# Altium project class_ab_three_stage.PrjPcb
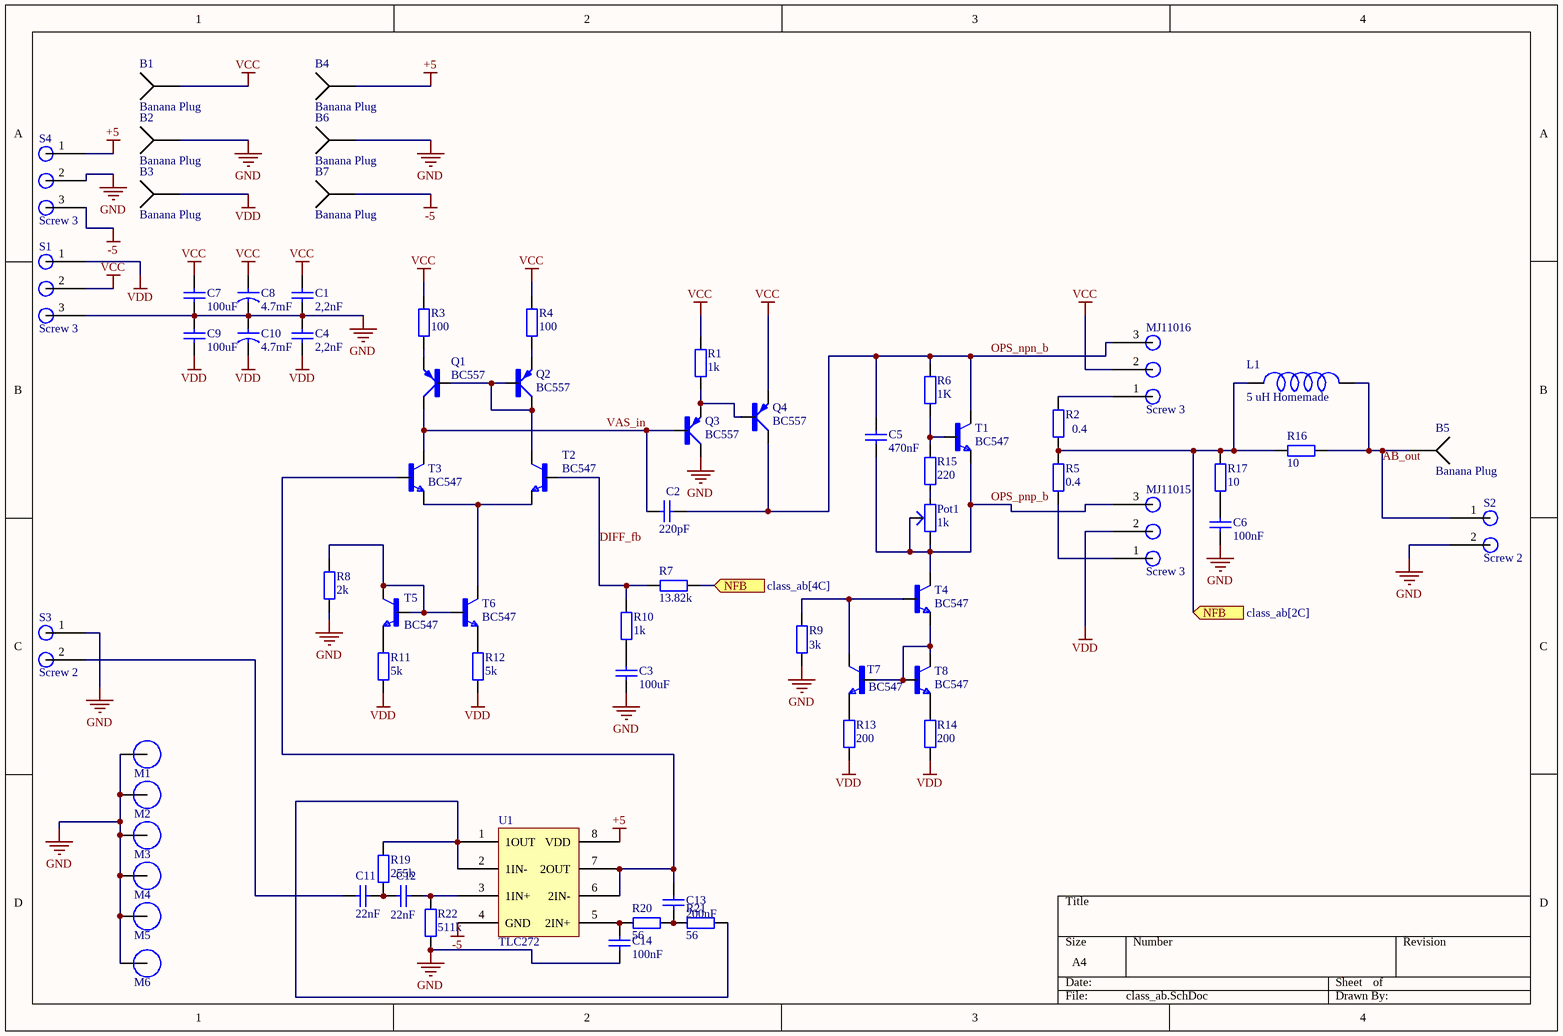
[diagram p0: class_ab.SchDoc]
1 sheet, 69 parts. Net scope: flat (ports and power ports of the same name join across sheets).
Board files: version1.PcbDoc, version2.PcbDoc

## Sheet class_ab.SchDoc
size A4; SheetNumber: 1; SheetTotal: 1; SPICEModelCacheNOEMFCAE: <root> / <DocumentId>NOEMFCAE</DocumentId> / </root>

### Parts
B1  Banana Plug  [Banana Plug On top]
B2  Banana Plug  [Banana Plug On top]
B3  Banana Plug  [Banana Plug On top]
B4  Banana Plug  [Banana Plug On top]
B5  Banana Plug  [Banana Plug On top]
B6  Banana Plug  [Banana Plug On top]
B7  Banana Plug  [Banana Plug On top]
C1  Capacity: 2,2nF  [Cap-1]  (hidden comment: Cap)
C2  Capacity: 220pF  [Cap-0]  (hidden comment: Cap)
C3  Capacity: 100uF  [Cap Ø8]  (hidden comment: Cap)
C4  Capacity: 2,2nF  [Cap-1]  (hidden comment: Cap)
C5  Capacity: 470nF  [Cap-1]  (hidden comment: Cap)
C6  Capacity: 100nF  [Cap-1]  (hidden comment: Cap)
C7  Capacity: 100uF  [Cap Ø8]  (hidden comment: Cap)
C8  Capacity: 4.7mF  [Cap Lyt Ø18]  (hidden comment: Cap)
C9  Capacity: 100uF  [Cap Ø8]  (hidden comment: Cap)
C10  Capacity: 4.7mF  [Cap Lyt Ø18]  (hidden comment: Cap)
C11  Capacity: 22nF  [Cap-1]  (hidden comment: Cap)
C12  Capacity: 22nF  [Cap-1]  (hidden comment: Cap)
C13  Capacity: 200nF  [Cap-1]  (hidden comment: Cap)
C14  Capacity: 100nF  [Cap-1]  (hidden comment: Cap)
L1  5 uH Homemade  [homecooked inductor]
M1  Screw Hole  [M3 Hole]  (value not drawn)
M2  Screw Hole  [M3 Hole]  (value not drawn)
M3  Screw Hole  [M3 Hole]  (value not drawn)
M4  Screw Hole  [M3 Hole]  (value not drawn)
M5  Screw Hole  [M3 Hole]  (value not drawn)
M6  Screw Hole  [M3 Hole]  (value not drawn)
MJ11015  Screw 3  [Screw-3]
MJ11016  Screw 3  [Screw-3]
Pot1  Resistance: 1k  [Pot trim slim high]  (hidden comment: Pot Trim)
Q1  BC557  [SOT54A]
Q2  BC557  [SOT54A]
Q3  BC557  [SOT54A]
Q4  BC557  [SOT54A]
R1  Ohm: 1k  [RES THT 9mm]  (hidden comment: Resistor)
R2  Ohm: 0.4  [RES THT 30mm]  (hidden comment: Resistor)
R3  Ohm: 100  [RES THT 9mm]  (hidden comment: Resistor)
R4  Ohm: 100  [RES THT 9mm]  (hidden comment: Resistor)
R5  Ohm: 0.4  [RES THT 30mm]  (hidden comment: Resistor)
R6  Ohm: 1K  [RES THT 9mm]  (hidden comment: Resistor)
R7  Ohm: 13.82k  [RES THT 9mm]  (hidden comment: Resistor)
R8  Ohm: 2k  [RES THT 9mm]  (hidden comment: Resistor)
R9  Ohm: 3k  [RES THT 9mm]  (hidden comment: Resistor)
R10  Ohm: 1k  [RES THT 9mm]  (hidden comment: Resistor)
R11  Ohm: 5k  [RES THT 9mm]  (hidden comment: Resistor)
R12  Ohm: 5k  [RES THT 9mm]  (hidden comment: Resistor)
R13  Ohm: 200  [RES THT 9mm]  (hidden comment: Resistor)
R14  Ohm: 200  [RES THT 9mm]  (hidden comment: Resistor)
R15  Ohm: 220  [RES THT 9mm]  (hidden comment: Resistor)
R16  Ohm: 10  [RES THT 9mm]  (hidden comment: Resistor)
R17  Ohm: 10  [Power RES 5 watt]  (hidden comment: Resistor)
R19  Ohm: 255k  [RES THT 9mm]  (hidden comment: Resistor)
R20  Ohm: 56  [RES THT 9mm]  (hidden comment: Resistor)
R21  Ohm: 56  [RES THT 9mm]  (hidden comment: Resistor)
R22  Ohm: 511k  [RES THT 9mm]  (hidden comment: Resistor)
S1  Screw 3  [Screw-3]
S2  Screw 2  [Screw-2]
S3  Screw 2  [Screw-2]
S4  Screw 3  [Screw-3]
T1  BC547  [TO92]
T2  BC547  [TO92]
T3  BC547  [TO92]
T4  BC547  [TO92]
T5  BC547  [TO92]
T6  BC547  [TO92]
T7  BC547  [TO92]
T8  BC547  [TO92]
U1  TLC272  [DIP-8]

### Ports
NFB (in, see class_ab[2C]), NFB (in, see class_ab[4C])

### Nets
+5: B4.1 S4.1 U1.8(VDD)
-5: B7.1 S4.3 U1.4(GND)
GND: B2.1 B6.1 C1.1 C3.1 C4.2(g) C6.1 C7.1 C8.2(g) C9.2(g) C10.1 C14.2(g) M1.1 M2.1 M3.1 M4.1 M5.1 M6.1 Q3.C R8.1 R9.1 R22.1 S1.3 S2.2 S3.1 S4.2
VCC: B1.1 C1.2(g) C7.2(g) C8.1 MJ11016.2 Q4.E R1.2 R3.2 R4.2 S1.2
VDD: B3.1 C4.1 C9.1 C10.2(g) MJ11015.2 R11.1 R12.1 R13.1 R14.1 S1.1
AB_out: B5.1 L1.2 R16.1 S2.1
DIFF_fb: R7.2 R10.1 T2.2(B)
OPS_npn_b: C2.2(g) C5.2(g) MJ11016.3 Q4.C R6.2 T1.1(C)
OPS_pnp_b: C5.1 MJ11015.3 Pot1.2 Pot1.3 T1.3(E) T4.1(C)
VAS_in: C2.1 Q1.C Q3.B T3.1(C)
NetC3_2: C3.2(g) R10.2
NetC6_2: C6.2(g) R17.1
NetC11_1: C11.1 C12.2(g) R19.1
NetC11_2: C11.2(g) S3.2
NetC12_1: C12.1 R22.2 U1.3(1IN+)
NetC13_1: C13.1 T3.2(B) U1.6(2IN-) U1.7(2OUT)
NetC13_2: C13.2(g) R20.1 R21.2
NetC14_1: C14.1 R20.2 U1.5(2IN+)
NetL1_1: L1.1 R2.1 R5.2 R7.1 R16.2 R17.2 ; port NFB
NetMJ11015_1: MJ11015.1 R5.1
NetMJ11016_1: MJ11016.1 R2.2
NetPot1_1: Pot1.1 R15.1
NetQ1_B: Q1.B Q2.B Q2.C T2.1(C)
NetQ1_E: Q1.E R3.1
NetQ2_E: Q2.E R4.1
NetQ3_E: Q3.E Q4.B R1.1
NetR6_1: R6.1 R15.2 T1.2(B)
NetR8_2: R8.2 T5.1(C) T5.2(B) T6.2(B)
NetR9_2: R9.2 T4.2(B) T7.1(C)
NetR11_2: R11.2 T5.3(E)
NetR12_2: R12.2 T6.3(E)
NetR13_2: R13.2 T7.3(E)
NetR14_2: R14.2 T8.3(E)
NetR19_2: R19.2 R21.1 U1.1(1OUT) U1.2(1IN-)
NetT2_3: T2.3(E) T3.3(E) T6.1(C)
NetT4_3: T4.3(E) T7.2(B) T8.1(C) T8.2(B)

### Library data of the parts
C1 C4-C6 C11-C14 = Capacitor 1 space
C2 = Capacitor 0 space
C3 C7 C9 = Capacitor unpolarized
C8 C10 = Capacitor electrolytic
L1 = homemade inductor
Pot1 = Pot Trim: Potentiometer
Q1-Q4 = BC557: Bipolar (BJT) Transistor PNP 45 V 100 mA 320MHz 625 mW Through Hole TO-92 (TO-226); MF: ON; Availability: In Stock; Package: E-PKG AXIAL-LEADED-2 ON Semiconductor; MP: BC557; Value: *; Check_prices: https://www.snapeda.com/parts/BC557/Onsemi/view-part/?ref=eda; SnapEDA_Link: https://www.snapeda.com/parts/BC557/Onsemi/view-part/?ref=snap; Price: None
T1-T8 = BC547: Trans GP BJT NPN 45V 0.1A 500mW 3-Pin TO-92 T/R; MF: ON Semiconductor; SnapEDA_Link: https://www.snapeda.com/parts/BC547/Onsemi/view-part/?ref=snap; Package: None; Value: *; MP: BC547; Check_prices: https://www.snapeda.com/parts/BC547/Onsemi/view-part/?ref=eda
U1 = TLC272: PRECISION DUAL OPERATIONAL AMPLIFIER